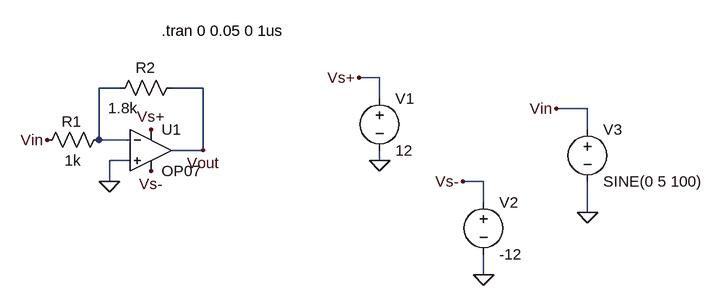
[diagram p0: schematic p03InvertingAmp.asc]
p03InvertingAmp.asc, the LTspice schematic file:
Version 4
SHEET 1 880 680
WIRE 192 -16 160 -16
WIRE -208 0 -240 0
WIRE -80 0 -128 0
WIRE 192 16 192 -16
WIRE 512 32 464 32
WIRE 512 64 512 32
WIRE -240 80 -240 0
WIRE -192 80 -240 80
WIRE -80 96 -80 0
WIRE -80 96 -128 96
WIRE -192 112 -224 112
WIRE 192 112 192 96
WIRE -224 144 -224 112
WIRE 352 144 320 144
WIRE 352 176 352 144
WIRE 512 192 512 144
WIRE 352 288 352 256
FLAG -224 144 0
FLAG -320 80 Vin
FLAG -160 64 Vs+
FLAG -160 128 Vs-
FLAG 192 112 0
FLAG 352 288 0
FLAG 512 192 0
FLAG 160 -16 Vs+
FLAG 464 32 Vin
FLAG 320 144 Vs-
FLAG -80 96 Vout
SYMBOL res -336 96 R270
WINDOW 0 29 54 VTop 2
WINDOW 3 0 56 VBottom 2
SYMATTR InstName R1
SYMATTR Value 1k
SYMBOL res -224 16 R270
WINDOW 0 32 56 VTop 2
WINDOW 3 1 21 VBottom 2
SYMATTR InstName R2
SYMATTR Value 1.8k
SYMBOL OpAmps\\OP07 -160 32 R0
SYMATTR InstName U1
SYMBOL voltage 192 0 R0
SYMATTR InstName V1
SYMATTR Value 12
SYMBOL voltage 352 160 R0
SYMATTR InstName V2
SYMATTR Value -12
SYMBOL voltage 512 48 R0
WINDOW 123 0 0 Left 0
WINDOW 39 0 0 Left 0
SYMATTR InstName V3
SYMATTR Value SINE(0 5 100)
TEXT -144 -88 Left 2 !.tran 0 0.05 0 1us

The netlist it stands for:
* p03InvertingAmp.asc
R1 Vin N001 1k
R2 N001 Vout 1.8k
XU1 0 N001 Vs+ Vs- Vout LT1001  ; OP07, pins In+ In- V+ V- OUT
V1 Vs+ 0 12
V2 Vs- 0 -12
V3 Vin 0 SINE(0 5 100)
.tran 0 0.05 0 1us
.lib LTC.lib
.backanno
.end